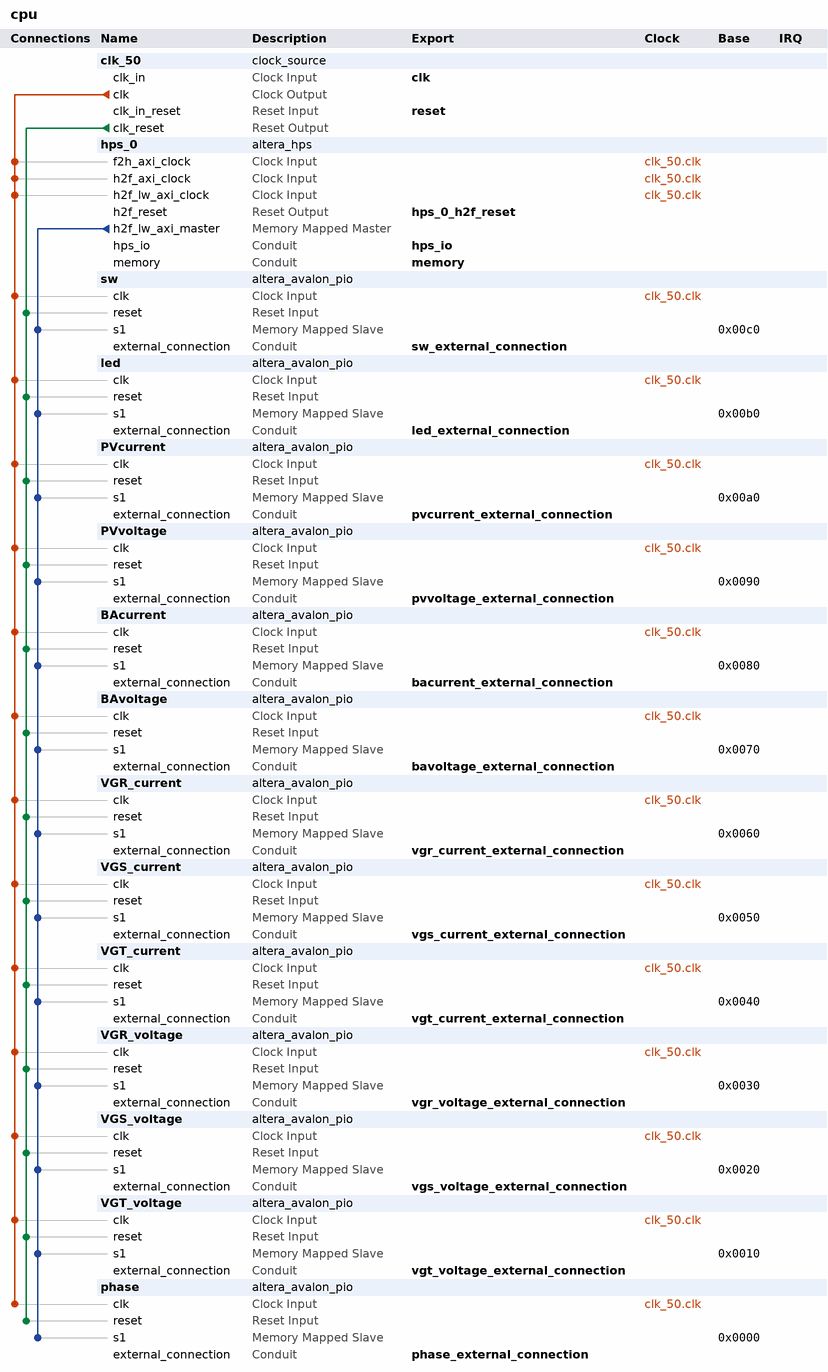
[diagram p0: system contents]
# Platform Designer (Qsys) system cpu, Cyclone V 5CSEBA6U23I7
# Parameters at their usual value, and those the tool derives, are not listed.
package require -exact qsys 18.1
create_system cpu
set_project_property DEVICE_FAMILY {Cyclone V}
set_project_property DEVICE 5CSEBA6U23I7

add_instance clk_50 clock_source 18.1
set_instance_parameter_value clk_50 clockFrequency 50000000

add_instance hps_0 altera_hps 18.1
set_instance_parameter_value hps_0 EMAC1_Mode RGMII
set_instance_parameter_value hps_0 EMAC1_PinMuxing {HPS I/O Set 0}
set_instance_parameter_value hps_0 F2SCLK_COLDRST_Enable false
set_instance_parameter_value hps_0 F2SCLK_DBGRST_Enable false
set_instance_parameter_value hps_0 F2SCLK_WARMRST_Enable false
set_instance_parameter_value hps_0 F2SINTERRUPT_Enable false
set_instance_parameter_value hps_0 F2S_Width 2
set_instance_parameter_value hps_0 FPGA_PERIPHERAL_OUTPUT_CLOCK_FREQ_EMAC0_GTX_CLK 125
set_instance_parameter_value hps_0 FPGA_PERIPHERAL_OUTPUT_CLOCK_FREQ_EMAC0_MD_CLK 2.5
set_instance_parameter_value hps_0 FPGA_PERIPHERAL_OUTPUT_CLOCK_FREQ_EMAC1_GTX_CLK 125
set_instance_parameter_value hps_0 FPGA_PERIPHERAL_OUTPUT_CLOCK_FREQ_EMAC1_MD_CLK 2.5
set_instance_parameter_value hps_0 HPS_PROTOCOL DDR3
set_instance_parameter_value hps_0 I2C0_Mode N/A
set_instance_parameter_value hps_0 I2C0_PinMuxing Unused
set_instance_parameter_value hps_0 I2C1_Mode N/A
set_instance_parameter_value hps_0 I2C1_PinMuxing Unused
set_instance_parameter_value hps_0 LWH2F_Enable true
set_instance_parameter_value hps_0 MEM_BANKADDR_WIDTH 3
set_instance_parameter_value hps_0 MEM_CLK_FREQ 400.0
set_instance_parameter_value hps_0 MEM_COL_ADDR_WIDTH 10
set_instance_parameter_value hps_0 MEM_DQ_WIDTH 32
set_instance_parameter_value hps_0 MEM_DRV_STR RZQ/6
set_instance_parameter_value hps_0 MEM_ROW_ADDR_WIDTH 15
set_instance_parameter_value hps_0 MEM_RTT_NOM RZQ/6
set_instance_parameter_value hps_0 MEM_RTT_WR {Dynamic ODT off}
set_instance_parameter_value hps_0 MEM_TCL 7
set_instance_parameter_value hps_0 MEM_TFAW_NS 37.5
set_instance_parameter_value hps_0 MEM_TRAS_NS 35.0
set_instance_parameter_value hps_0 MEM_TRCD_NS 13.75
set_instance_parameter_value hps_0 MEM_TRFC_NS 300.0
set_instance_parameter_value hps_0 MEM_TRP_NS 13.75
set_instance_parameter_value hps_0 MEM_VENDOR JEDEC
set_instance_parameter_value hps_0 MEM_WTCL 7
set_instance_parameter_value hps_0 QSPI_Mode N/A
set_instance_parameter_value hps_0 QSPI_PinMuxing Unused
set_instance_parameter_value hps_0 REF_CLK_FREQ 25.0
set_instance_parameter_value hps_0 S2FCLK_USER2CLK 5
set_instance_parameter_value hps_0 S2F_Width 2
set_instance_parameter_value hps_0 SDIO_Mode {4-bit Data}
set_instance_parameter_value hps_0 SDIO_PinMuxing {HPS I/O Set 0}
set_instance_parameter_value hps_0 SPIM1_Mode N/A
set_instance_parameter_value hps_0 SPIM1_PinMuxing Unused
set_instance_parameter_value hps_0 STM_Enable false
set_instance_parameter_value hps_0 TIMING_BOARD_AC_SKEW 0.02
set_instance_parameter_value hps_0 TIMING_BOARD_AC_TO_CK_SKEW 0.0
set_instance_parameter_value hps_0 TIMING_BOARD_DQ_TO_DQS_SKEW 0.0
set_instance_parameter_value hps_0 TIMING_BOARD_MAX_CK_DELAY 0.6
set_instance_parameter_value hps_0 TIMING_BOARD_MAX_DQS_DELAY 0.6
set_instance_parameter_value hps_0 TIMING_BOARD_SKEW_BETWEEN_DQS 0.02
set_instance_parameter_value hps_0 TIMING_BOARD_SKEW_CKDQS_DIMM_MAX 0.01
set_instance_parameter_value hps_0 TIMING_BOARD_SKEW_CKDQS_DIMM_MIN -0.01
set_instance_parameter_value hps_0 TIMING_BOARD_SKEW_WITHIN_DQS 0.02
set_instance_parameter_value hps_0 TIMING_TDH 125
set_instance_parameter_value hps_0 TIMING_TDQSCK 400
set_instance_parameter_value hps_0 TIMING_TDQSQ 120
set_instance_parameter_value hps_0 TIMING_TDS 50
set_instance_parameter_value hps_0 TIMING_TIH 250
set_instance_parameter_value hps_0 TIMING_TIS 175
set_instance_parameter_value hps_0 TIMING_TQSH 0.38
set_instance_parameter_value hps_0 UART0_Mode {No Flow Control}
set_instance_parameter_value hps_0 UART0_PinMuxing {HPS I/O Set 0}
set_instance_parameter_value hps_0 USB1_Mode SDR
set_instance_parameter_value hps_0 USB1_PinMuxing {HPS I/O Set 0}
set_instance_parameter_value hps_0 desired_cfg_clk_mhz 100.0
set_instance_parameter_value hps_0 desired_qspi_clk_mhz 400.0

add_instance sw altera_avalon_pio 18.1
set_instance_parameter_value sw direction Input
set_instance_parameter_value sw width 3

add_instance led altera_avalon_pio 18.1
set_instance_parameter_value led direction Output
set_instance_parameter_value led width 3

add_instance PVcurrent altera_avalon_pio 18.1
set_instance_parameter_value PVcurrent direction Input
set_instance_parameter_value PVcurrent width 12

add_instance PVvoltage altera_avalon_pio 18.1
set_instance_parameter_value PVvoltage direction Input
set_instance_parameter_value PVvoltage width 12

add_instance BAcurrent altera_avalon_pio 18.1
set_instance_parameter_value BAcurrent direction Input
set_instance_parameter_value BAcurrent width 12

add_instance BAvoltage altera_avalon_pio 18.1
set_instance_parameter_value BAvoltage direction Input
set_instance_parameter_value BAvoltage width 12

add_instance VGR_current altera_avalon_pio 18.1
set_instance_parameter_value VGR_current direction Input
set_instance_parameter_value VGR_current width 12

add_instance VGS_current altera_avalon_pio 18.1
set_instance_parameter_value VGS_current direction Input
set_instance_parameter_value VGS_current width 12

add_instance VGT_current altera_avalon_pio 18.1
set_instance_parameter_value VGT_current direction Input
set_instance_parameter_value VGT_current width 12

add_instance VGR_voltage altera_avalon_pio 18.1
set_instance_parameter_value VGR_voltage direction Input
set_instance_parameter_value VGR_voltage width 12

add_instance VGS_voltage altera_avalon_pio 18.1
set_instance_parameter_value VGS_voltage direction Input
set_instance_parameter_value VGS_voltage width 12

add_instance VGT_voltage altera_avalon_pio 18.1
set_instance_parameter_value VGT_voltage direction Input
set_instance_parameter_value VGT_voltage width 12

add_instance phase altera_avalon_pio 18.1
set_instance_parameter_value phase direction InOut
set_instance_parameter_value phase width 12

# connections
add_connection clk_50.clk BAcurrent.clk clock
add_connection clk_50.clk BAvoltage.clk clock
add_connection clk_50.clk hps_0.f2h_axi_clock clock
add_connection clk_50.clk hps_0.h2f_axi_clock clock
add_connection clk_50.clk hps_0.h2f_lw_axi_clock clock
add_connection clk_50.clk led.clk clock
add_connection clk_50.clk phase.clk clock
add_connection clk_50.clk PVcurrent.clk clock
add_connection clk_50.clk PVvoltage.clk clock
add_connection clk_50.clk sw.clk clock
add_connection clk_50.clk VGR_current.clk clock
add_connection clk_50.clk VGR_voltage.clk clock
add_connection clk_50.clk VGS_current.clk clock
add_connection clk_50.clk VGS_voltage.clk clock
add_connection clk_50.clk VGT_current.clk clock
add_connection clk_50.clk VGT_voltage.clk clock
add_connection clk_50.clk_reset BAcurrent.reset reset
add_connection clk_50.clk_reset BAvoltage.reset reset
add_connection clk_50.clk_reset led.reset reset
add_connection clk_50.clk_reset phase.reset reset
add_connection clk_50.clk_reset PVcurrent.reset reset
add_connection clk_50.clk_reset PVvoltage.reset reset
add_connection clk_50.clk_reset sw.reset reset
add_connection clk_50.clk_reset VGR_current.reset reset
add_connection clk_50.clk_reset VGR_voltage.reset reset
add_connection clk_50.clk_reset VGS_current.reset reset
add_connection clk_50.clk_reset VGS_voltage.reset reset
add_connection clk_50.clk_reset VGT_current.reset reset
add_connection clk_50.clk_reset VGT_voltage.reset reset
add_connection hps_0.h2f_lw_axi_master BAcurrent.s1 avalon
set_connection_parameter_value hps_0.h2f_lw_axi_master/BAcurrent.s1 baseAddress 0x0080
add_connection hps_0.h2f_lw_axi_master BAvoltage.s1 avalon
set_connection_parameter_value hps_0.h2f_lw_axi_master/BAvoltage.s1 baseAddress 0x0070
add_connection hps_0.h2f_lw_axi_master led.s1 avalon
set_connection_parameter_value hps_0.h2f_lw_axi_master/led.s1 baseAddress 0x00b0
add_connection hps_0.h2f_lw_axi_master phase.s1 avalon
set_connection_parameter_value hps_0.h2f_lw_axi_master/phase.s1 baseAddress 0x0000
add_connection hps_0.h2f_lw_axi_master PVcurrent.s1 avalon
set_connection_parameter_value hps_0.h2f_lw_axi_master/PVcurrent.s1 baseAddress 0x00a0
add_connection hps_0.h2f_lw_axi_master PVvoltage.s1 avalon
set_connection_parameter_value hps_0.h2f_lw_axi_master/PVvoltage.s1 baseAddress 0x0090
add_connection hps_0.h2f_lw_axi_master sw.s1 avalon
set_connection_parameter_value hps_0.h2f_lw_axi_master/sw.s1 baseAddress 0x00c0
add_connection hps_0.h2f_lw_axi_master VGR_current.s1 avalon
set_connection_parameter_value hps_0.h2f_lw_axi_master/VGR_current.s1 baseAddress 0x0060
add_connection hps_0.h2f_lw_axi_master VGR_voltage.s1 avalon
set_connection_parameter_value hps_0.h2f_lw_axi_master/VGR_voltage.s1 baseAddress 0x0030
add_connection hps_0.h2f_lw_axi_master VGS_current.s1 avalon
set_connection_parameter_value hps_0.h2f_lw_axi_master/VGS_current.s1 baseAddress 0x0050
add_connection hps_0.h2f_lw_axi_master VGS_voltage.s1 avalon
set_connection_parameter_value hps_0.h2f_lw_axi_master/VGS_voltage.s1 baseAddress 0x0020
add_connection hps_0.h2f_lw_axi_master VGT_current.s1 avalon
set_connection_parameter_value hps_0.h2f_lw_axi_master/VGT_current.s1 baseAddress 0x0040
add_connection hps_0.h2f_lw_axi_master VGT_voltage.s1 avalon
set_connection_parameter_value hps_0.h2f_lw_axi_master/VGT_voltage.s1 baseAddress 0x0010

# exported interfaces
add_interface bacurrent_external_connection conduit end
set_interface_property bacurrent_external_connection EXPORT_OF BAcurrent.external_connection
add_interface bavoltage_external_connection conduit end
set_interface_property bavoltage_external_connection EXPORT_OF BAvoltage.external_connection
add_interface clk clock sink
set_interface_property clk EXPORT_OF clk_50.clk_in
add_interface hps_0_h2f_reset reset source
set_interface_property hps_0_h2f_reset EXPORT_OF hps_0.h2f_reset
add_interface hps_io conduit end
set_interface_property hps_io EXPORT_OF hps_0.hps_io
add_interface led_external_connection conduit end
set_interface_property led_external_connection EXPORT_OF led.external_connection
add_interface memory conduit end
set_interface_property memory EXPORT_OF hps_0.memory
add_interface phase_external_connection conduit end
set_interface_property phase_external_connection EXPORT_OF phase.external_connection
add_interface pvcurrent_external_connection conduit end
set_interface_property pvcurrent_external_connection EXPORT_OF PVcurrent.external_connection
add_interface pvvoltage_external_connection conduit end
set_interface_property pvvoltage_external_connection EXPORT_OF PVvoltage.external_connection
add_interface reset reset sink
set_interface_property reset EXPORT_OF clk_50.clk_in_reset
add_interface sw_external_connection conduit end
set_interface_property sw_external_connection EXPORT_OF sw.external_connection
add_interface vgr_current_external_connection conduit end
set_interface_property vgr_current_external_connection EXPORT_OF VGR_current.external_connection
add_interface vgr_voltage_external_connection conduit end
set_interface_property vgr_voltage_external_connection EXPORT_OF VGR_voltage.external_connection
add_interface vgs_current_external_connection conduit end
set_interface_property vgs_current_external_connection EXPORT_OF VGS_current.external_connection
add_interface vgs_voltage_external_connection conduit end
set_interface_property vgs_voltage_external_connection EXPORT_OF VGS_voltage.external_connection
add_interface vgt_current_external_connection conduit end
set_interface_property vgt_current_external_connection EXPORT_OF VGT_current.external_connection
add_interface vgt_voltage_external_connection conduit end
set_interface_property vgt_voltage_external_connection EXPORT_OF VGT_voltage.external_connection

set_interconnect_requirement {$system} qsys_mm.clockCrossingAdapter HANDSHAKE
set_interconnect_requirement {$system} qsys_mm.enableEccProtection FALSE
set_interconnect_requirement {$system} qsys_mm.insertDefaultSlave FALSE
set_interconnect_requirement {$system} qsys_mm.maxAdditionalLatency 1

save_system cpu.qsys
